# EAGLE design FSK_test (EAGLE 6.5.0)
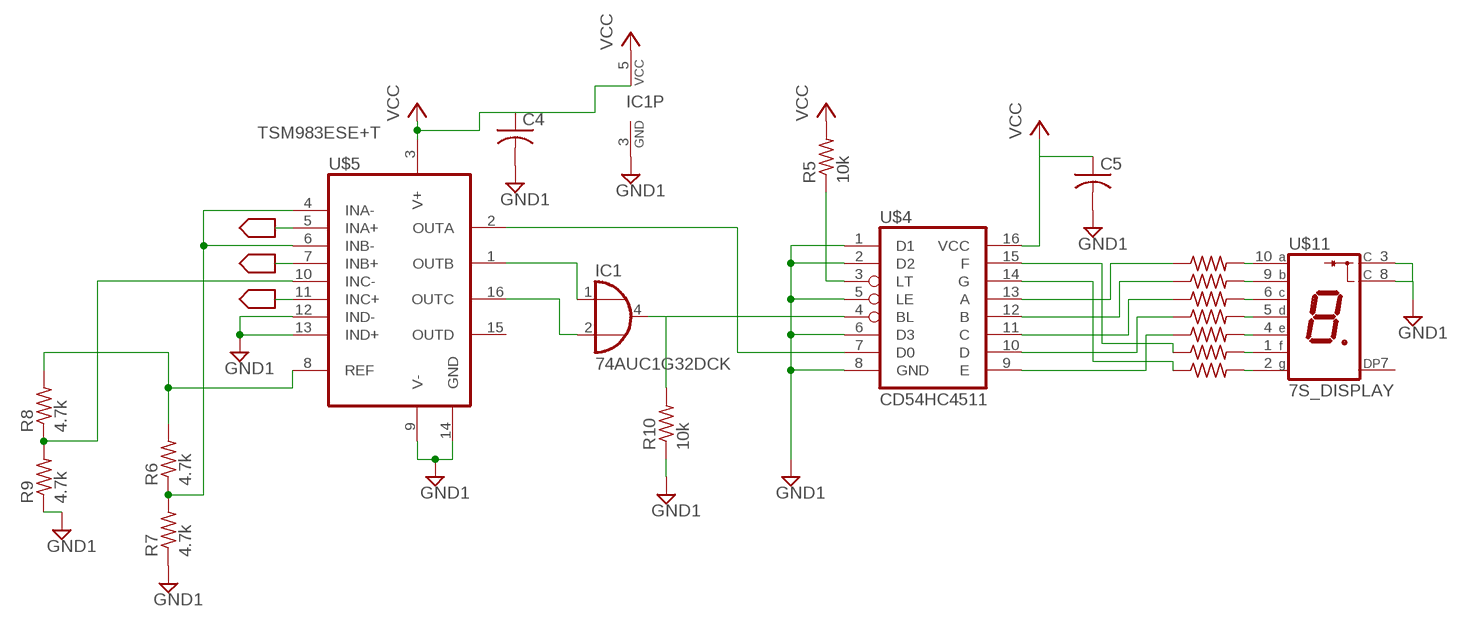
[diagram p0: schematic, sheet 1]

## Parts
C4  C-USC0603  [C0603]
C5  C-USC0603  [C0603]
IC1  74AUC1G32DCK  [SC70-5]
R5  10k  R-US_R1206  [R1206]
R6  4.7k  R-US_R1206  [R1206]
R7  4.7k  R-US_R1206  [R1206]
R8  4.7k  R-US_R1206  [R1206]
R9  4.7k  R-US_R1206  [R1206]
R10  10k  R-US_R1206  [R1206]
R11  R-US_R0603  [R0603]
R12  R-US_R0603  [R0603]
R13  R-US_R0603  [R0603]
R14  R-US_R0603  [R0603]
R15  R-US_R0603  [R0603]
R16  R-US_R0603  [R0603]
R17  R-US_R0603  [R0603]
U$4  CD54HC4511  [CD54HC4511]
U$5  TSM983ESE+T  [TSM983ESE+T]
U$11  7S_DISPLAY  [7S_DISPLAY]

## Nets
2.4_OUT: U$5.5(INA+)
2.6_OUT: U$5.7(INB+) U$5.11(INC+)
GND1: C4.2 C5.2 IC1.3(GND) R7.1 R9.1 R10.1 U$4.1(D1) U$4.2(D2) U$4.5(LE) U$4.6(D3) U$4.8(GND) U$5.9(V-) U$5.12(IND-) U$5.13(IND+) U$5.14(GND) U$11.3(C) U$11.8(C)
N$1: IC1.4(O) R10.2 U$4.4(BL)
N$2: IC1.1(I0) U$5.1(OUTB)
N$3: R11.2 U$11.10(A)
N$4: R12.2 U$11.9(B)
N$6: U$4.7(D0) U$5.2(OUTA)
N$7: R13.2 U$11.6(C)
N$8: IC1.2(I1) U$5.16(OUTC)
N$9: R8.1 R9.2 U$5.10(INC-)
N$10: R6.2 R8.2 U$5.8(REF)
N$11: R6.1 R7.2 U$5.4(INA-) U$5.6(INB-)
N$12: R5.1 U$4.3(LT)
N$13: R14.2 U$11.5(D)
N$14: R15.2 U$11.4(E)
N$15: R16.2 U$11.1(F)
N$16: R17.2 U$11.2(G)
N$17: R11.1 U$4.13(A)
N$18: R12.1 U$4.12(B)
N$19: R13.1 U$4.11(C)
N$20: R14.1 U$4.10(D)
N$21: R15.1 U$4.9(E)
N$22: R16.1 U$4.15(F)
N$23: R17.1 U$4.14(G)
VCC: C4.1 C5.1 IC1.5(VCC) R5.2 U$4.16(VCC) U$5.3(V+)
Unconnected: U$5.15(OUTD) U$11.7(DP)

## Library data of the parts
C4 C5 = rcl:C-US: CAPACITOR, American symbol
IC1 = 74xx-little-de:74*1G32: 2-input OR gate
R5-R17 = rcl:R-US_: RESISTOR, American symbol
U$4 = ECE532_Parts:CD54HC4511
U$5 = ECE532_Parts:TSM983ESE+T
U$11 = ECE532_Parts:7S_DISPLAY

## Board
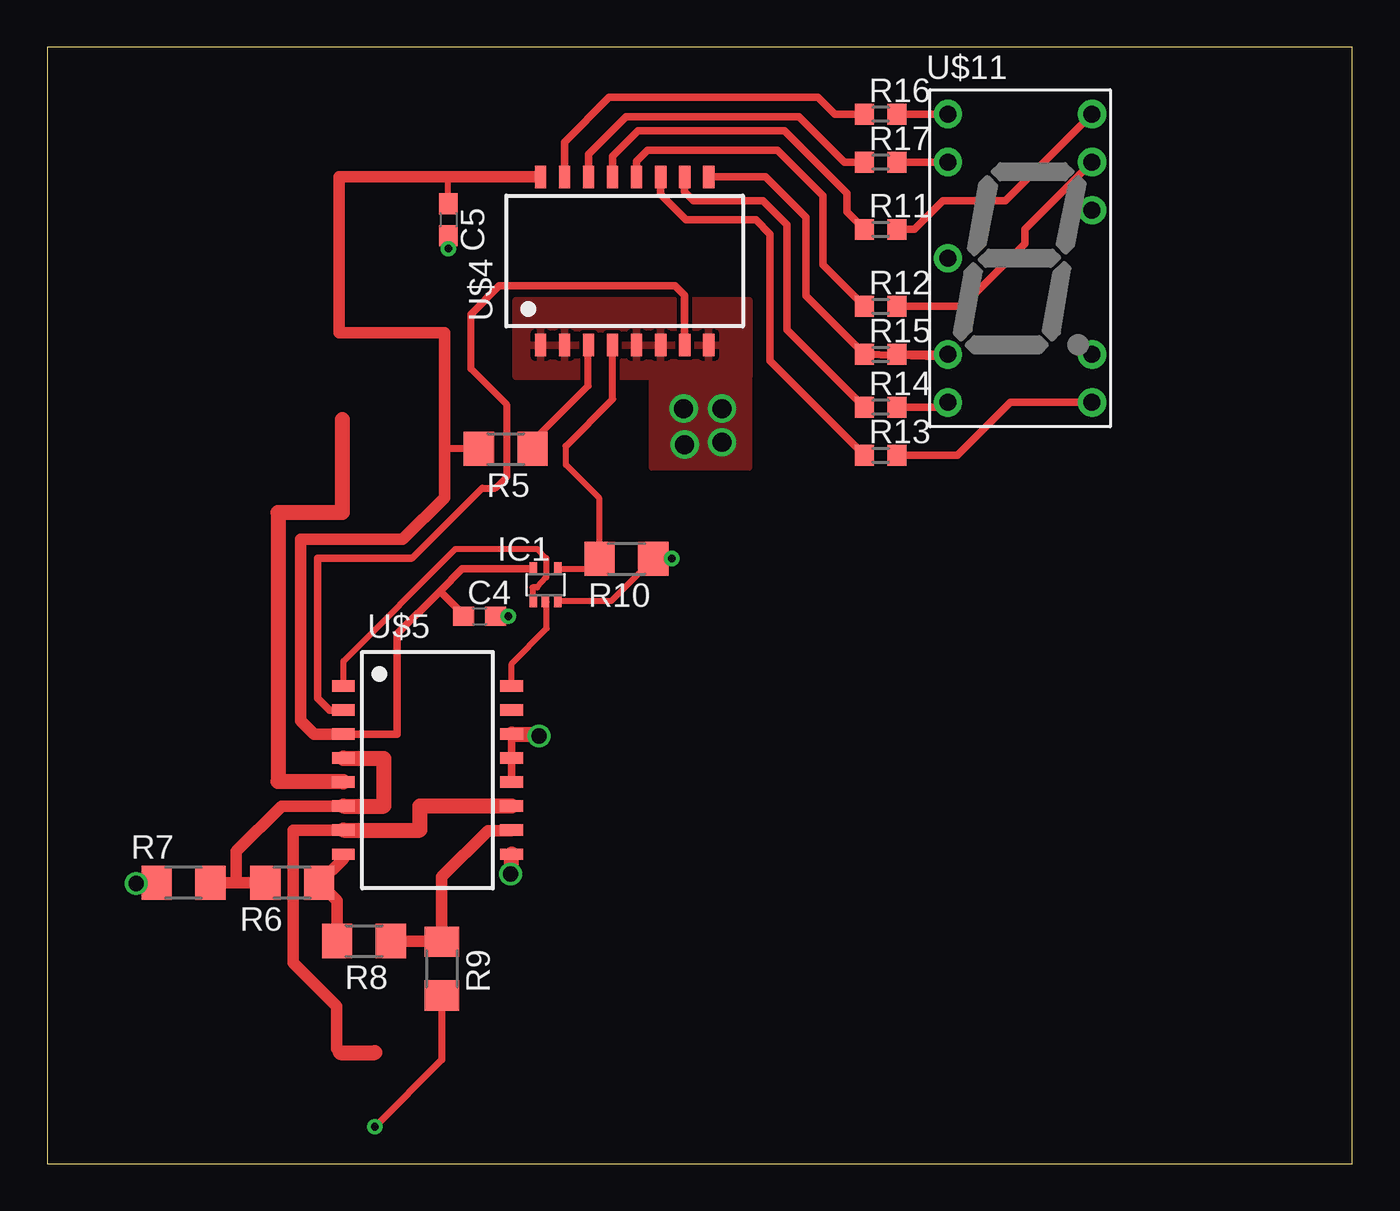
[diagram p1: board, top side]
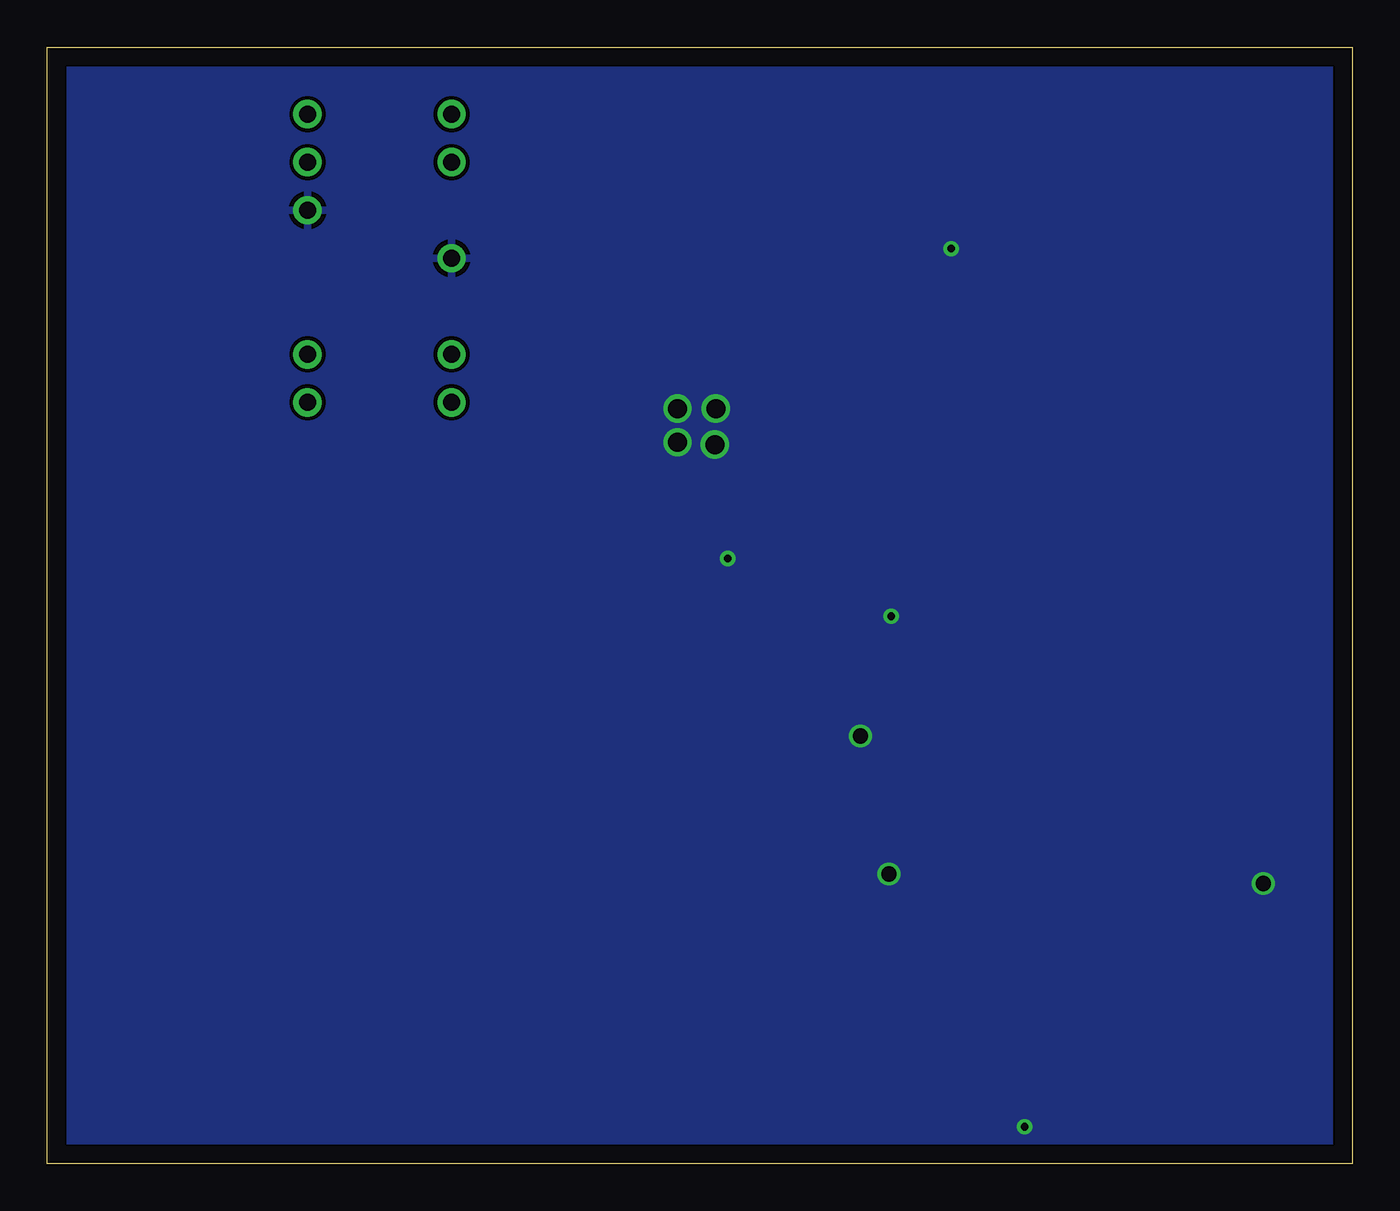
[diagram p2: board, bottom side, seen from below]

Size 69 x 59 mm. Coordinates in mm from the lower left corner, seen from the top.
Outline: 0,0 69,0 69,59 0,59 0,0
Copper layers (1*16): Top 0.035mm / dielectric 1.5mm / Bottom 0.035mm
Design rules "default": minimum track width 10mil, minimum drill 24mil, track to track 8mil, track to pad 8mil, pad to pad 8mil, via to via 8mil, smd to smd 8mil, copper to edge 40mil, drill to drill 8mil, minimum pad ring 10mil, minimum via ring 8mil, stop-mask expansion 4mil, vias tented up to drill 0mil, thermal gap 10mil

### Footprints (pad centres in the part's own frame; a part is rotated, then mirrored left to right if it is on the bottom)
C0603 = smd 1.1 x 1: 1 -0.85,0; 2 0.85,0
SC70-5 = smd 0.4 x 0.7: 1 -0.65,-0.85; 2 0,-0.85; 3 0.65,-0.85; 4 0.65,0.85; 5 -0.65,0.85
R1206 = smd 1.6 x 1.803: 1 -1.422,0; 2 1.422,0
R0603 = smd 1 x 1.1: 1 -0.85,0; 2 0.85,0
CD54HC4511 = smd 1.2 x 0.6: 1 -4.445,3.175; 2 -4.445,1.905; 3 -4.445,0.635; 4 -4.445,-0.635; 5 -4.445,-1.905; 6 -4.445,-3.175; 7 -4.445,-4.445; 8 -4.445,-5.715; 9 4.445,-5.715; 10 4.445,-4.445; 11 4.445,-3.175; 12 4.445,-1.905; 13 4.445,-0.635; 14 4.445,0.635; 15 4.445,1.905; 16 4.445,3.175
TSM983ESE+T = smd 1.2 x 0.6: 1 -4.445,4.445; 2 -4.445,3.175; 3 -4.445,1.905; 4 -4.445,0.635; 5 -4.445,-0.635; 6 -4.445,-1.905; 7 -4.445,-3.175; 8 -4.445,-4.445; 9 4.445,-4.445; 10 4.445,-3.175; 11 4.445,-1.905; 12 4.445,-0.635; 13 4.445,0.635; 14 4.445,1.905; 15 4.445,3.175; 16 4.445,4.445
7S_DISPLAY = drill 0.9 pad 1.5: 1 -1.27,7.62; 2 -1.27,5.08; 3 -1.27,0; 4 -1.27,-5.08; 5 -1.27,-7.62; 6 6.35,-7.62; 7 6.35,-5.08; 8 6.35,2.54; 9 6.35,5.08; 10 6.35,7.62

### Placement (x,y rotation side)
C4  22.86,28.93 0 top
C5  21.2,49.88 270 top
IC1  26.34,30.59 0 top
R5  24.24,37.77 180 top
R6  12.96,14.84 0 top
R7  7.21,14.84 0 top
R8  16.74,11.76 180 top
R9  20.86,10.31 90 top
R10  30.62,31.96 180 top
R11  44.06,49.37 0 top
R12  44.06,45.31 0 top
R13  44.06,37.44 0 top
R14  44.06,39.98 0 top
R15  44.06,42.77 0 top
R16  44.06,55.47 0 top
R17  44.06,52.93 0 top
U$4  29.25,47.7 90 top
U$5  20.1,20.8 0 top
U$11  48.89,47.85 0 top

### Tracks (layer width: path | path; a pad name or v marks a point on that pad's centre or on a via)
2.4_OUT
  Top 0.8: 15.6,39.34 15.6,34.4 12.2,34.4 12.2,20.2 15.66,20.2 U$5.5
2.6_OUT
  Top 0.6: U$5.7 13,17.62 13,10.6 15.3,8.3 15.3,6.06 15.5,5.86
  Top 0.8: U$5.7 19.7,17.62 19.7,18.9 U$5.11 | 15.5,5.86 17.33,5.86
GND1  (via drill 0.4, 0.8, 1)
  Top 0.305: C4.2 v24.38,28.93 | v33.02,31.97 33,31.96 R10.1 29.82,29.74 IC1.3 | C5.2 v21.2,48.36
  Top 0.381: R9.1 20.86,5.48 v17.32,1.95
  Top 0.4: U$5.12 U$5.13
  Top 0.406: v17.32,1.95 17.33,1.95 | U$5.13 U$5.14
  Top 0.6: v4.7,14.8 5.75,14.8 R7.1
  Top 0.8: U$5.14 26,22.7 v26,22.6 | v24.5,15.3 24.55,15.3 U$5.9
  other vias: 35.68,39.9 33.7,38 33.65,39.9 35.68,38.12
  pour Bottom: -4,79 180,79 180,-13 -4,-13
  pour Top: 24.8,45.6 37.11,45.6 37.11,41.6 24.8,41.6
  pour Top: 32,41.88 37.08,41.88 37.08,36.8 32,36.8
N$1
  Top 0.305: IC1.4 28.68,31.44 R10.2 29.2,35.15 27.43,36.93 27.43,37.92 27.42,37.92
  Top 0.381: 27.42,37.92 29.9,40.4 U$4.4
N$2
  Top 0.305: U$5.1 15.66,26.56 21.59,32.48 25.9,32.48 26.38,31.99 26.38,30.98 25.9,30.45 25.65,30.45 25.65,29.78 IC1.1
N$3
  Top 0.406: R11.2 45.84,49.37 47.37,50.9 50.67,50.9 U$11.10
N$4
  Top 0.406: R12.2 48.38,45.31 51.69,48.61 51.69,49.37 U$11.9
N$6
  Top 0.381: 19.2,32 19.3,32 23,35.7 23.7,35.7 24.3,36.3 24.3,40.1 22.4,42 22.4,44.9
  Top 0.4: U$5.2 14.93,23.97 14.3,24.6 14.3,32 19.2,32 | 22.4,44.9 23.9,46.4 33.2,46.4 33.7,45.9 U$4.7 | U$4.7
N$7
  Top 0.406: R13.2 48.13,37.44 50.92,40.23 U$11.6
N$8
  Top 0.305: U$5.16 24.55,26.43 26.41,28.29 26.41,29.67 IC1.2
N$9
  Top 0.6: R8.1 20.83,11.76 R9.2 20.86,15.16 23.3,17.6 24.53,17.6 U$5.10
N$10
  Top 0.6: R6.2 | U$5.8 15.66,16.12 R6.2 | R8.2 15.32,13.9 R6.2
N$11
  Top 0.6: R6.1 10.1,14.84 | 10.1,14.84 R7.2 | U$5.6 12.39,18.89 10,16.5 10,14.94 10.1,14.84
  Top 0.8: U$5.6 17.8,18.89 17.8,21.4 15.66,21.4 U$5.4
N$12
  Top 0.381: R5.1 25.66,38.16 28.6,41.1 28.6,43.24 U$4.3
N$13
  Top 0.406: R14.2 47.37,39.98 U$11.5
N$14
  Top 0.406: R15.2 U$11.4
N$15
  Top 0.406: R16.2 U$11.1
N$16
  Top 0.406: R17.2 U$11.2
N$17
  Top 0.4: 38.73,54.58 38.98,54.58 42.29,51.28 42.29,50.3 R11.1
  Top 0.406: U$4.13 29.89,53.23 31.24,54.58 38.73,54.58
N$18
  Top 0.4: 38.6,53.56 41.02,51.15 41.02,47.51 R12.1
  Top 0.406: U$4.12 31.16,52.98 31.75,53.56 38.6,53.56
N$19
  Top 0.4: U$4.11 32.43,51.23 33.78,49.88 37.46,49.88 38.22,49.12 38.22,42.43 R13.1
N$20
  Top 0.4: U$4.10 33.7,51.36 34.16,50.9 37.84,50.9 39.11,49.63 39.11,44.08 R14.1
N$21
  Top 0.4: 37.73,52.15 37.99,52.15 40.13,50.01 40.13,45.86 R15.1
  Top 0.406: U$4.9 37.73,52.15 | 47.24,42.64 R15.1
N$22
  Top 0.4: 29.71,56.36 40.76,56.36 41.65,55.47 R16.1
  Top 0.406: U$4.15 27.35,53.99 29.71,56.36
N$23
  Top 0.4: U$4.14 28.62,53.36 30.6,55.34 39.75,55.34 42.16,52.93 R17.1
VCC
  Top 0.305: C5.1 21.2,52.15
  Top 0.381: R5.2 21.21,37.77 21,37.56
  Top 0.4: IC1.5 21.94,31.44 20.76,30.26 18.5,28 18.5,22.7 U$5.3 | U$5.3
  Top 0.406: C4.1 22.01,29.01 20.76,30.26
  Top 0.6: U$5.3 14.1,22.7 13.4,23.4 13.4,33 18.8,33 21,35.2 21,37.56 21,43.9 15.43,43.9 15.43,52.15 21.2,52.15 U$4.16